# Altium schematic sheet Ctrl.SchDoc
size A; SheetNumber: 4; SheetTotal: 6
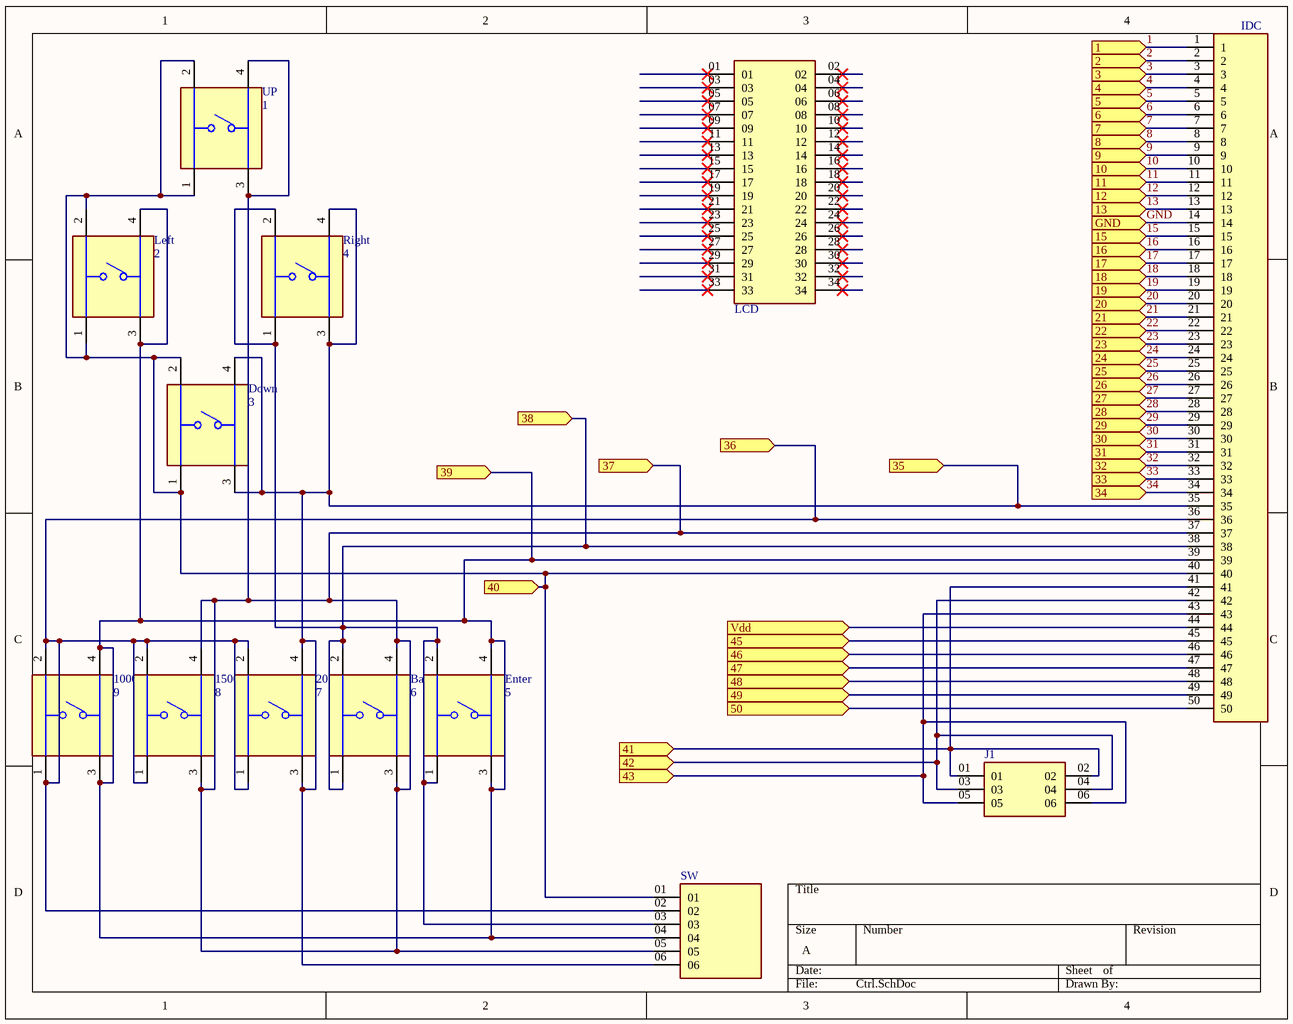
[diagram p0: Ctrl.SchDoc]

## Parts
1000  9  [SW_TS01-66-73-BK-100-D]
1500  8  [SW_TS01-66-73-BK-100-D]
2000  7  [SW_TS01-66-73-BK-100-D]
Back  6  [SW_TS01-66-73-BK-100-D]
Down  3  [SW_TS01-66-73-BK-100-D]
Enter  5  [SW_TS01-66-73-BK-100-D]
IDC  1-1761686-5  [TE_1-1761686-5]  (value not drawn)
J1  MTLW-103-07-L-D-320  [SAMTEC_MTLW-103-07-L-D-320]  (value not drawn)
LCD  TSW-117-23-G-D  [SAMTEC_TSW-117-23-G-D]  (value not drawn)
Left  2  [SW_TS01-66-73-BK-100-D]
Right  4  [SW_TS01-66-73-BK-100-D]
SW  MTLW-106-05-T-S-137  [SAMTEC_MTLW-106-05-T-S-137]  (value not drawn)
UP  1  [SW_TS01-66-73-BK-100-D]

## Ports
1 (in, see finetunebox[2A], BordBox[4A]), 2 (in, see finetunebox[2A], BordBox[4A]), 3 (in, see finetunebox[2A], BordBox[4A]), 4 (in, see finetunebox[2A], BordBox[4A]), 5 (in, see finetunebox[2A], BordBox[4B]), 6 (in, see finetunebox[2A], BordBox[4B]), 7 (in, see finetunebox[2A], BordBox[4B]), 8 (in, see finetunebox[2A], BordBox[4B]), 9 (in, see finetunebox[2A], BordBox[4B]), 10 (in, see finetunebox[2A], BordBox[4B]), 11 (in, see finetunebox[2A], BordBox[4B]), 12 (in, see finetunebox[2A], BordBox[4B]), 13 (in, see finetunebox[2A], BordBox[4B]), 15 (in, see finetunebox[2B], BordBox[4B]), 16 (in, see finetunebox[2B], BordBox[4B]), 17 (in, see finetunebox[2B], BordBox[4B]), 18 (in, see finetunebox[2B], BordBox[4B]), 19 (in, see finetunebox[2B], BordBox[4B]), 20 (in, see finetunebox[2B], BordBox[4B]), 21 (in, see finetunebox[2B], BordBox[4B]), 22 (in, see finetunebox[2B], BordBox[4B]), 23 (in, see finetunebox[2B], BordBox[4B]), 24 (in, see finetunebox[2B], BordBox[4C]), 25 (in, see finetunebox[2B], BordBox[4C]), 26 (in, see finetunebox[2B], BordBox[4C]), 27 (in, see finetunebox[2B], BordBox[4C]), 28 (in, see finetunebox[2B], BordBox[4C]), 29 (in, see finetunebox[2B], BordBox[4C]), 30 (in, see finetunebox[2B], BordBox[4C]), 31 (in, see finetunebox[2B], BordBox[4C]), 32 (in, see finetunebox[2B], BordBox[4C]), 33 (in, see finetunebox[2C], BordBox[4C]), 34 (in, see finetunebox[2C], BordBox[4C]), 35 (in, see finetunebox[2C], BordBox[4C]), 36 (in, see finetunebox[2C], BordBox[4C]), 37 (in, see finetunebox[2C], BordBox[4C]), 38 (in, see finetunebox[2C], BordBox[4C]), 39 (in, see finetunebox[2C], BordBox[4C]), 40 (in, see finetunebox[2C], BordBox[4C]), 41 (in, see finetunebox[2C], BordBox[4C]), 42 (in, see finetunebox[2C], BordBox[4C]), 43 (in, see finetunebox[2C], BordBox[4D]), 45 (in, see finetunebox[2C], BordBox[4D]), 46 (in, see finetunebox[2C], BordBox[4D]), 47 (in, see finetunebox[2C], BordBox[4D]), 48 (in, see finetunebox[2C], BordBox[4D]), 49 (in, see finetunebox[2C], BordBox[4D]), 50 (in, see finetunebox[2C], BordBox[4D]), GND (in, see finetunebox[2B], BordBox[1B], BordBox[4B], parametrboard[1B]), Vdd (in, see finetunebox[2C], BordBox[4D])

## Nets
1: IDC.1 ; port 1
2: IDC.2 ; port 2
3: IDC.3 ; port 3
4: IDC.4 ; port 4
5: IDC.5 ; port 5
6: IDC.6 ; port 6
7: IDC.7 ; port 7
8: IDC.8 ; port 8
9: IDC.9 ; port 9
10: IDC.10 ; port 10
11: IDC.11 ; port 11
12: IDC.12 ; port 12
13: IDC.13 ; port 13
15: IDC.15 ; port 15
16: IDC.16 ; port 16
17: IDC.17 ; port 17
18: IDC.18 ; port 18
19: IDC.19 ; port 19
20: IDC.20 ; port 20
21: IDC.21 ; port 21
22: IDC.22 ; port 22
23: IDC.23 ; port 23
24: IDC.24 ; port 24
25: IDC.25 ; port 25
26: IDC.26 ; port 26
27: IDC.27 ; port 27
28: IDC.28 ; port 28
29: IDC.29 ; port 29
30: IDC.30 ; port 30
31: IDC.31 ; port 31
32: IDC.32 ; port 32
33: IDC.33 ; port 33
34: IDC.34 ; port 34
35: 2000.3 2000.4 Down.3 Down.4 IDC.35 Right.3 Right.4 SW.06 ; port 35
36: 1000.1 1000.2 1500.1 1500.2 2000.1 2000.2 IDC.36 SW.02 ; port 36
37: 1500.3 1500.4 Back.3 Back.4 IDC.37 SW.05 UP.3 UP.4 ; port 37
38: Back.1 Back.2 Enter.1 Enter.2 IDC.38 Right.1 Right.2 SW.03 ; port 38
39: 1000.3 1000.4 Enter.3 Enter.4 IDC.39 Left.3 Left.4 SW.04 ; port 39
40: Down.1 Down.2 IDC.40 Left.1 Left.2 SW.01 UP.1 UP.2 ; port 40
41: IDC.41 J1.01 J1.02 ; port 41
42: IDC.42 J1.03 J1.04 ; port 42
43: IDC.43 J1.05 J1.06 ; port 43
45: IDC.45 ; port 45
46: IDC.46 ; port 46
47: IDC.47 ; port 47
48: IDC.48 ; port 48
49: IDC.49 ; port 49
50: IDC.50 ; port 50
GND: IDC.14 ; port GND
Vdd: IDC.44 ; port Vdd

Not connected (* = marked no-connect by the designer): LCD 01* 02* 03* 04* 05* 06* 07* 08* 09* 10* 11* 12* 13* 14* 15* 16* 17* 18* 19* 20* 21* 22* 23* 24* 25* 26* 27* 28* 29* 30* 31* 32* 33* 34*

## Library data of the parts
1000 1500 2000 Back Down Enter Left Right UP = TS01-66-73-BK-100-D: 6 x 6 mm, 7.3 mm Actuator Height, 100 gf, Black, Long Crimped, Through Hole, SPST, Tactile Switch; MF: Same Sky; SnapEDA_Link: https://www.snapeda.com/parts/TS01-66-73-BK-100-D/Same+Sky/view-part/?ref=snap; Package: None; Value: *; MP: TS01-66-73-BK-100-D; Check_prices: https://www.snapeda.com/parts/TS01-66-73-BK-100-D/Same+Sky/view-part/?ref=eda
IDC = 1-1761686-5: Package: None; Price: None; Value: *; MP: 1-1761686-5; Availability: Unavailable
J1 = MTLW-103-07-L-D-320: MP: MTLW-103-07-L-D-320; Package: None; Price: None; Availability: Unavailable; Value: *
LCD = TSW-117-23-G-D: Package: None; Price: None; Value: *; MP: TSW-117-23-G-D; Availability: Unavailable
SW = MTLW-106-05-T-S-137: Value: *; Price: None; Package: None; Availability: Unavailable; MP: MTLW-106-05-T-S-137